# EasyEDA Pro project main_board.eprj

# Schematic Schematic1
Board Name: Board1; Create Date: 2025-07-29; Page Name: P1; Project Name: main_board; Schematic Name: Schematic1; Update Date: 2025-08-04; Company: EasyEDA.com; Page Size: A4; Version: V1.0
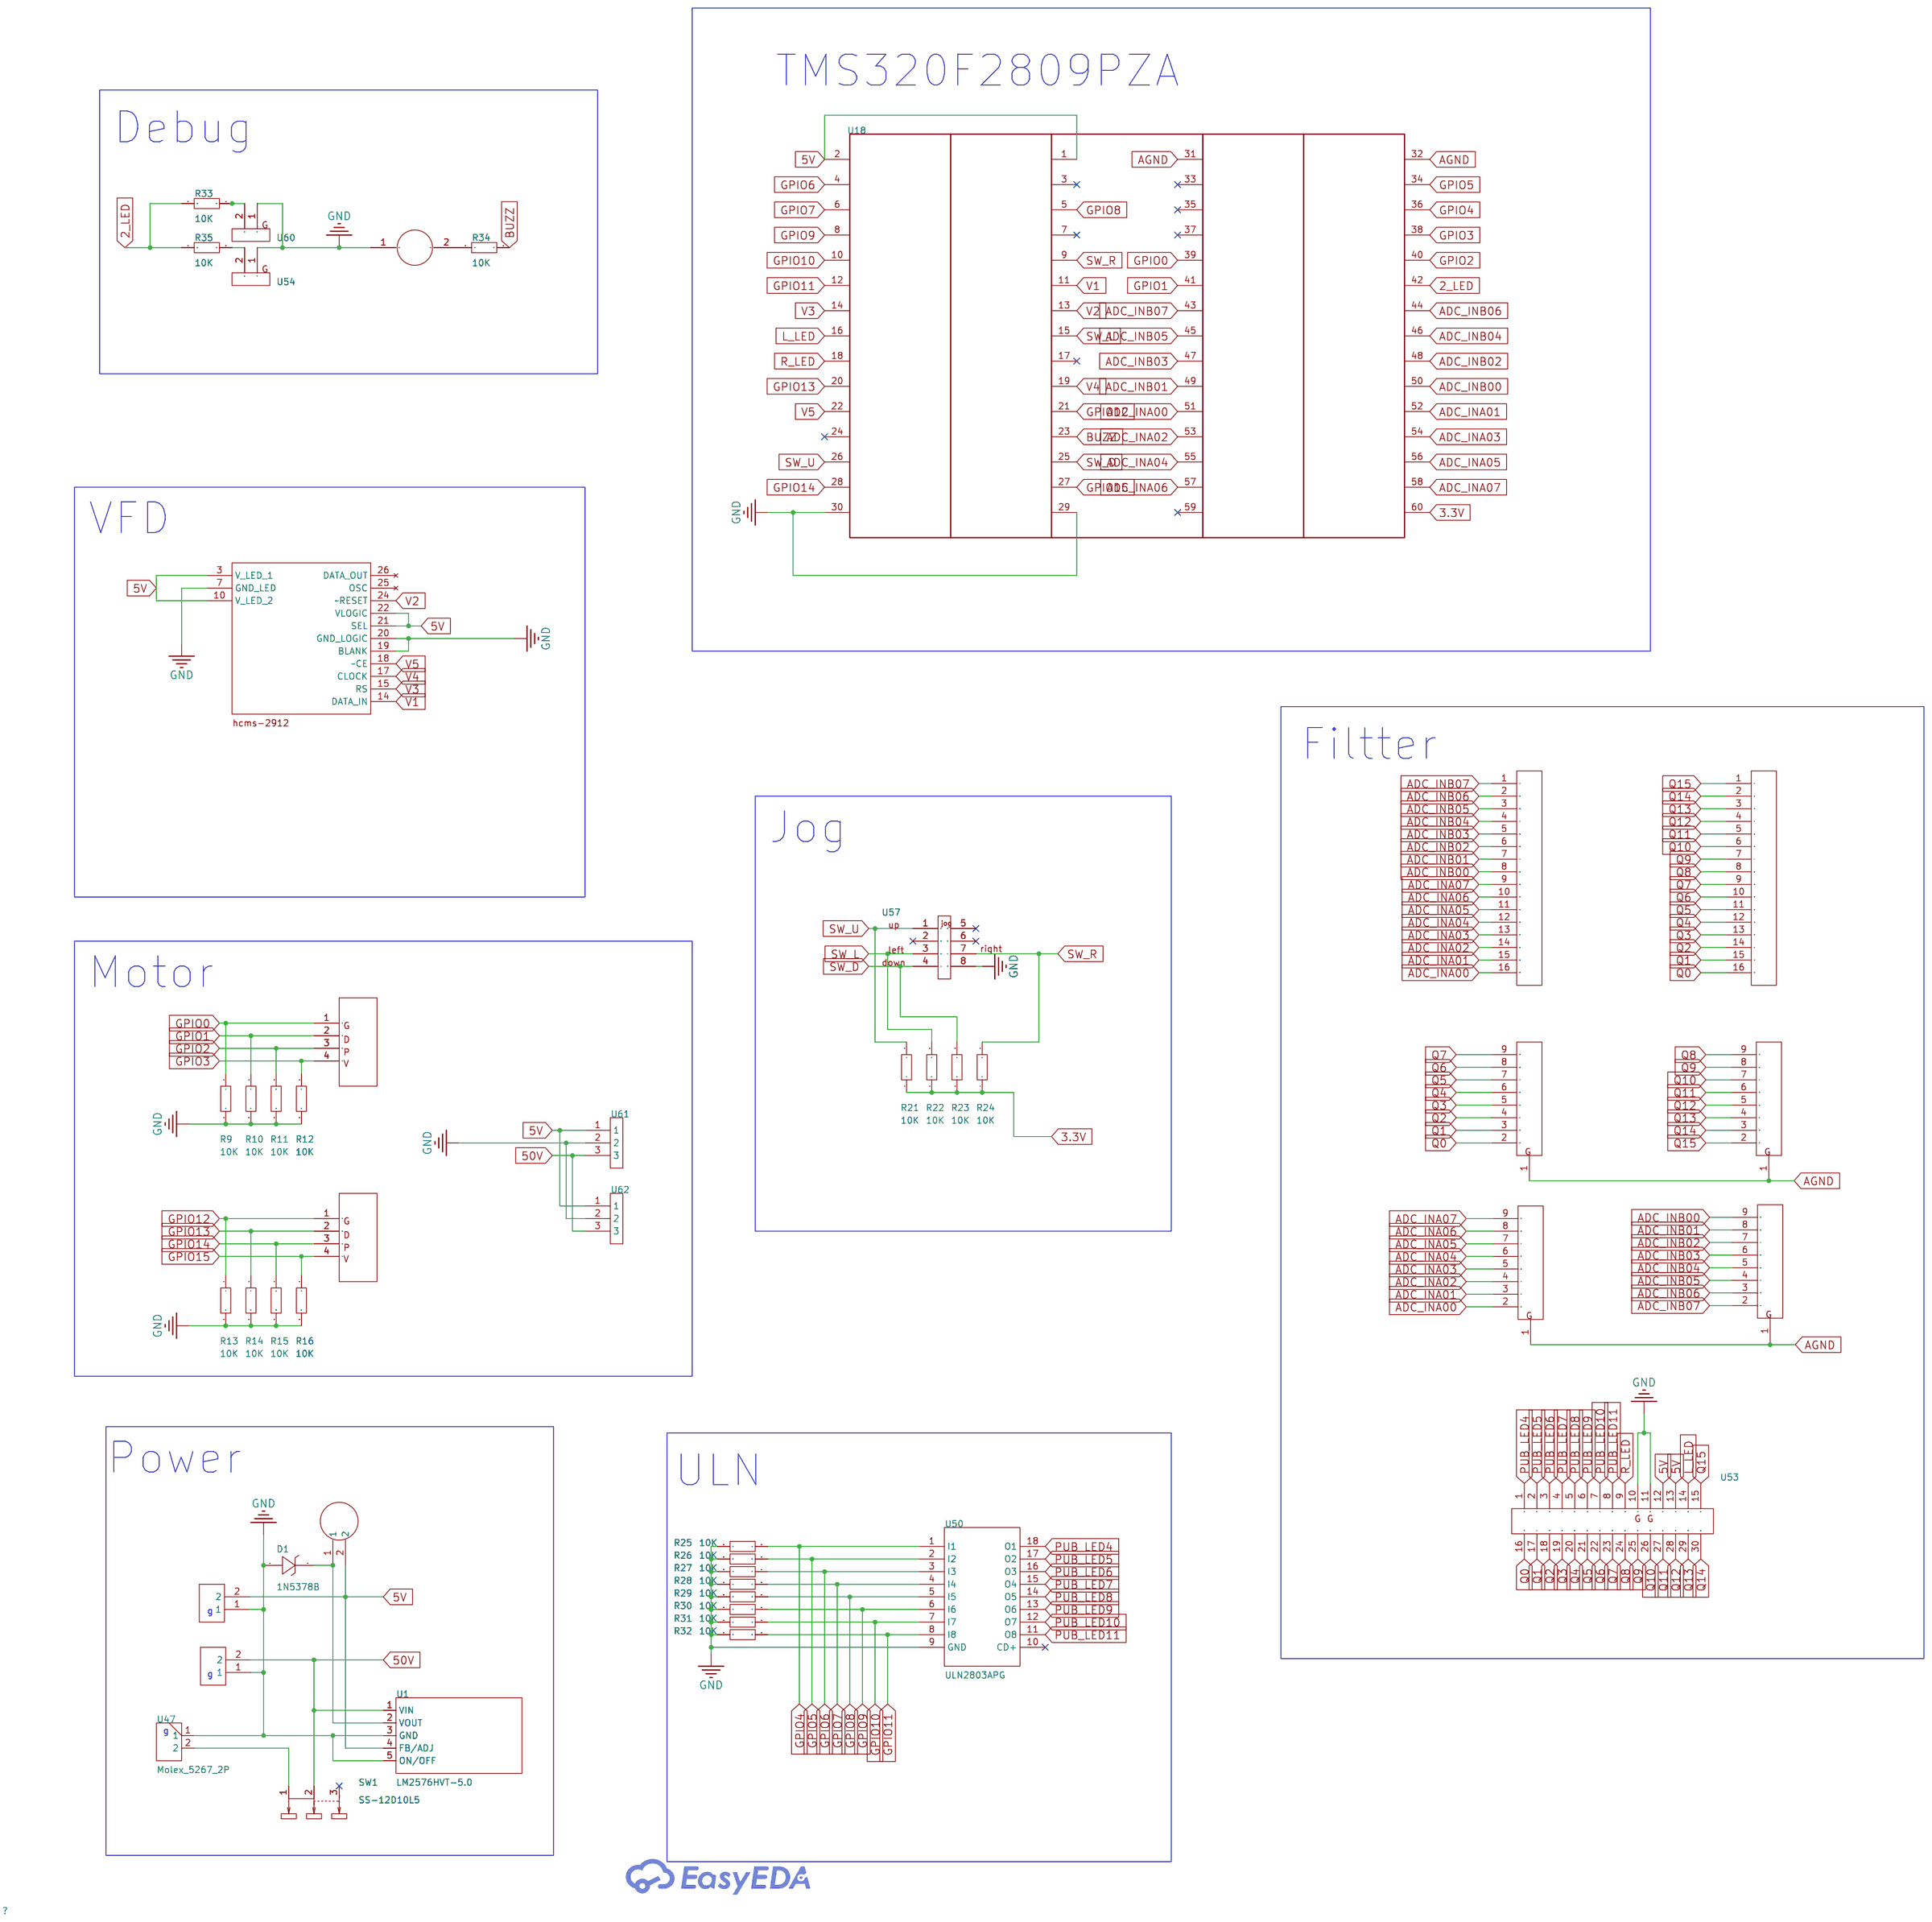
[diagram p0: schematic sheet]

## Parts
C1  -  [100uF Capacitor]
C2  -  [1000uF Capacitor]
D1  1N5378B  [DO-15_BD3.1-L6.7-P10.70-D0.9-FD]
L1  -  [Indoctor]
R9  10K  [R0603]
R10  10K  [R0603]
R11  10K  [R0603]
R12  10K  [R0603]
R13  10K  [R0603]
R14  10K  [R0603]
R15  10K  [R0603]
R16  10K  [R0603]
R21  10K  [R0603]
R22  10K  [R0603]
R23  10K  [R0603]
R24  10K  [R0603]
R25  10K  [R0603]
R26  10K  [R0603]
R27  10K  [R0603]
R28  10K  [R0603]
R29  10K  [R0603]
R30  10K  [R0603]
R31  10K  [R0603]
R32  10K  [R0603]
R33  10K  [R0603]
R34  10K  [R0603]
R35  10K  [R0603]
SW1  SS-12D10L5  [SW-TH_SS-12D10L5]
U1  LM2576HVT-5.0  [TO-220-5L_L10.2-W4.5-P1.71-L]
U4  Driver_R  [DC_Main_to_Motordriver_Connector_L]
U6  -  [BUZZER]
U10  -  [HCMS-2912]
U11  -  [Array]
U12  -  [Array]
U15  -  [C_Array]
U16  -  [C_Array]
U18  -  [2809PCB]
U47  Molex_5267_2P  [5267_2P]
U48  Driver_L  [DC_Main_to_Motordriver_Connector_L]
U50  ULN2803APG  [DIP-18_L23.0-W6.5-P2.54-LS7.6-BL]
U51  -  [Array]
U52  -  [Array]
U53  -  [pin2*15]
U54  -  [pub_pin]
U57  -  [jog]
U60  -  [pub_pin]
U61  -  [pin]
U62  -  [pin]

## Library data of the parts
C1 = 100uF Capacitor
C2 = 1000uF Capacitor
D1 = 1N5378B: Zener Voltage(Nom):100V Reverse Leakage Current (Ir):500nA@76V Pd - Power Dissipation:5W Impedance(Zzt):90Ω; Supplier Part: C2988330; Manufacturer: EIC; Supplier Footprint: DO-15; JLCPCB Part Class: Extended Part; Datasheet: https://atta.szlcsc.com/upload/public/pdf/source/20220402/75CFD8A39FA764DF5610AA6DE4D072CD.pdf; Supplier: LCSC; Zener Voltage(Nom): 100V; Reverse Leakage Current (Ir): 500nA@76V; Pd - Power Dissipation: 5W; Impedance(Zzt): 90Ω
L1 = Indoctor
R9-R16 R21-R35 = Res_0603: Supplier Footprint: 0603
SW1 = SS-12D10L5: LCSC Part Name: 柄长5mm 直插双档 滑动开关; Supplier Part: C319012; Manufacturer: XKB Connectivity(中国星坤); Supplier Footprint: 插件; JLCPCB Part Class: Extended Part; Datasheet: https://atta.szlcsc.com/upload/public/pdf/source/20211009/D6412F37AABE6F9459A6EE7FA4DAEADB.pdf; Supplier: LCSC; Circuit: SPDT; Actuator Style: Rectangular columnar; Pin Style: PCPin; Switch Length: 13mm; Switch Width: 6.8mm; Switch Height: 6.4mm; Mounting Style: Straight; Actuator Color: Black; Current Rating (DC): 3A; Voltage Rating (DC): 125V; Current Rating (AC): 3A; Voltage Rating (AC): 125V; Mechanical Life: 1万次; Operating Temperature: -40℃~+85℃
U1 = LM2576HVT-5.0_C262789: Function:Step-down type Output Type:- Voltage - Supply:- Voltage - Supply:- Output Voltage:- Output Voltage:- Output Current:3A Frequency - Switching:52kHz Frequency - Switching:52kHz Operating Temperature:-40℃~+125℃ Operating Temperature:-40℃~+125℃ Synch; Supplier Part: C262789; Manufacturer: HTC; Supplier Footprint: TO-220-5; JLCPCB Part Class: Extended Part; Datasheet: https://atta.szlcsc.com/upload/public/pdf/source/20191203/C126037_E42ABC3D16C6AA3446C45CA7229A4210.pdf; Supplier: LCSC; Function: Step-down type; Output Current: 3A; Frequency - Switching: 52kHz; Operating Temperature: -40℃~+125℃; Number of Outputs: 1; Topology: Step-down; Switch tube (built-in/external): Built-in
U4 U48 = DC_Main_to_Motordriver_Connector
U6 = BUZZER
U10 = HCMS-2912
U11 U12 U51 U52 = Array
U15 U16 = C_Array
U18 = TMS320F2809PZA_DIP
U47 = Molex_5267_2P
U50 = ULN2803APG: LCSC Part Name: 停产 ULN2803APG; Supplier Part: C5252; Manufacturer: TOSHIBA(东芝); Supplier Footprint: DIP-18; JLCPCB Part Class: Extended Part; Datasheet: https://atta.szlcsc.com/upload/public/pdf/source/20120920/1457706536068.pdf; Supplier: LCSC; number of channels: Eight channels
U53 = pin2*15
U54 U60 = pub_pin
U57 = jog
U61 U62 = 3pin

## Nets
3.3V: R21.1 R22.1 R23.1 R24.1 U18.60
5V: C2.2 L1.2 U1.4(FB/ADJ) U10.3(V_LED_1) U10.10(V_LED_2) U10.21(SEL) U10.22(VLOGIC) U18.1 U18.2 U53.12 U53.13 U61.1 U62.1
50V: C1.2 SW1.2 U1.1(VIN) U61.3 U62.3
AGND: U11.1 U12.1 U18.31 U18.32 U51.1 U52.1
GND: C1.1 C2.1 D1.1(+) R9.2 R10.2 R11.2 R12.2 R13.2 R14.2 R15.2 R16.2 R25.2 R26.2 R27.2 R28.2 R29.2 R30.2 R31.2 R32.2 U1.3(GND) U1.5(ON/OFF) U6.1 U10.7(GND_LED) U10.19(BLANK) U10.20(GND_LOGIC) U18.29 U18.30 U47.1 U50.9(GND) U53.10 U53.11 U54.1 U57.8 U60.1 U61.2 U62.2
V1: U10.14(DATA_IN) U18.11
V2: U10.24(~RESET) U18.13
V3: U10.15(RS) U18.14
V4: U10.17(CLOCK) U18.19
V5: U10.18(~CE) U18.22
2_LED: R33.1 R35.1 U18.42
ADC_INA00: U15.16 U18.51 U51.2
ADC_INA01: U15.15 U18.52 U51.3
ADC_INA02: U15.14 U18.53 U51.4
ADC_INA03: U15.13 U18.54 U51.5
ADC_INA04: U15.12 U18.55 U51.6
ADC_INA05: U15.11 U18.56 U51.7
ADC_INA06: U15.10 U18.57 U51.8
ADC_INA07: U15.9 U18.58 U51.9
ADC_INB00: U15.8 U18.50 U52.9
ADC_INB01: U15.7 U18.49 U52.8
ADC_INB02: U15.6 U18.48 U52.7
ADC_INB03: U15.5 U18.47 U52.6
ADC_INB04: U15.4 U18.46 U52.5
ADC_INB05: U15.3 U18.45 U52.4
ADC_INB06: U15.2 U18.44 U52.3
ADC_INB07: U15.1 U18.43 U52.2
BUZZ: R34.2 U18.23
GPIO0: R9.1 U4.1 U18.39
GPIO1: R10.1 U4.2 U18.41
GPIO2: R11.1 U4.3 U18.40
GPIO3: R12.1 U4.4 U18.38
GPIO4: R25.1 U18.36 U50.1(I1)
GPIO5: R26.1 U18.34 U50.2(I2)
GPIO6: R27.1 U18.4 U50.3(I3)
GPIO7: R28.1 U18.6 U50.4(I4)
GPIO8: R29.1 U18.5 U50.5(I5)
GPIO9: R30.1 U18.8 U50.6(I6)
GPIO10: R31.1 U18.10 U50.7(I7)
GPIO11: R32.1 U18.12 U50.8(I8)
GPIO12: R13.1 U18.21 U48.1
GPIO13: R14.1 U18.20 U48.2
GPIO14: R15.1 U18.28 U48.3
GPIO15: R16.1 U18.27 U48.4
L_LED: U18.16 U53.14
PUB_LED4: U50.18(O1) U53.1
PUB_LED5: U50.17(O2) U53.2
PUB_LED6: U50.16(O3) U53.3
PUB_LED7: U50.15(O4) U53.4
PUB_LED8: U50.14(O5) U53.5
PUB_LED9: U50.13(O6) U53.6
PUB_LED10: U50.12(O7) U53.7
PUB_LED11: U50.11(O8) U53.8
Q0: U11.2 U16.16 U53.16
Q1: U11.3 U16.15 U53.17
Q2: U11.4 U16.14 U53.18
Q3: U11.5 U16.13 U53.19
Q4: U11.6 U16.12 U53.20
Q5: U11.7 U16.11 U53.21
Q6: U11.8 U16.10 U53.22
Q7: U11.9 U16.9 U53.23
Q8: U12.9 U16.8 U53.24
Q9: U12.8 U16.7 U53.25
Q10: U12.7 U16.6 U53.26
Q11: U12.6 U16.5 U53.27
Q12: U12.5 U16.4 U53.28
Q13: U12.4 U16.3 U53.29
Q14: U12.3 U16.2 U53.30
Q15: U12.2 U16.1 U53.15
R_LED: U18.18 U53.9
SW_D: R23.2 U18.25 U57.4
SW_L: R22.2 U18.15 U57.3
SW_R: R24.2 U18.9 U57.7
SW_U: R21.2 U18.26 U57.1
$1N2932: SW1.1 U47.2
$1N3052: D1.2(-) L1.1 U1.2(VOUT)
$1N13779: R34.1 U6.2
$1N16910: R33.2 U60.2
$1N16913: R35.2 U54.2

Not connected (* = marked no-connect by the designer): SW1 3*; U10 25(OSC) 26(DATA_OUT); U18 3* 7* 17* 24* 33* 35* 37* 59*; U50 10(CD+)*; U57 2* 5* 6*

## Notes on the sheet
- TMS320F2809PZA
- Debug
- VFD
- Filtter
- Jog
- Motor
- Power
- ULN
- g
- g
- g

# Board PCB1
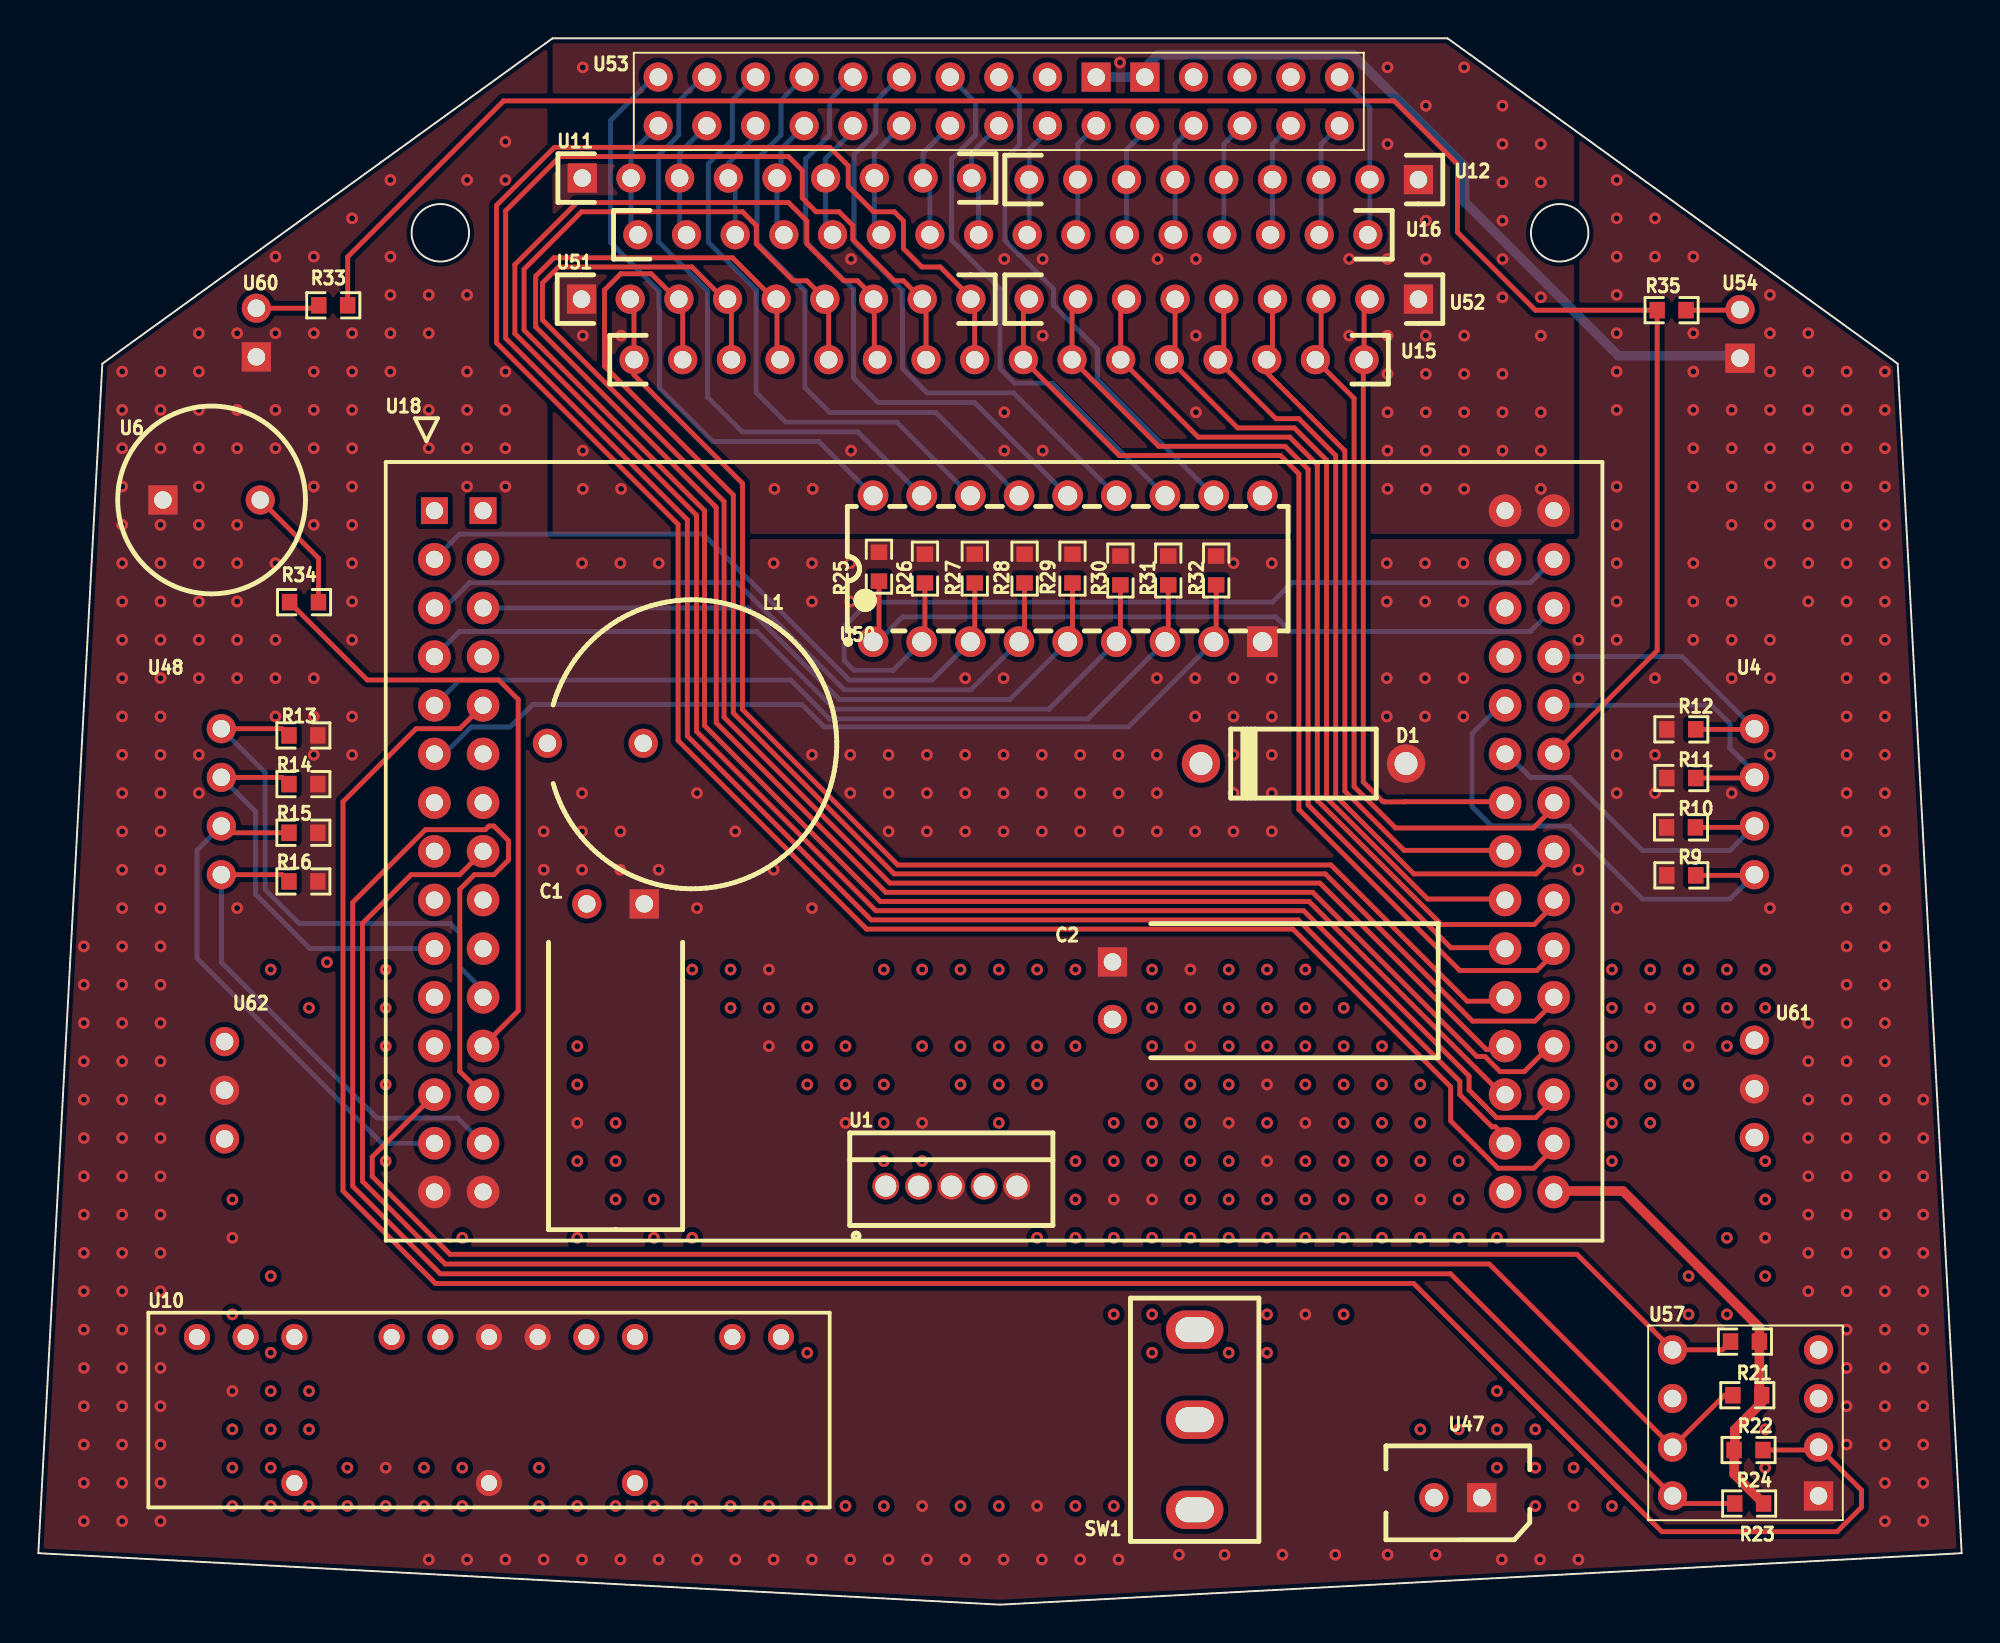
[diagram p1: board, top side]
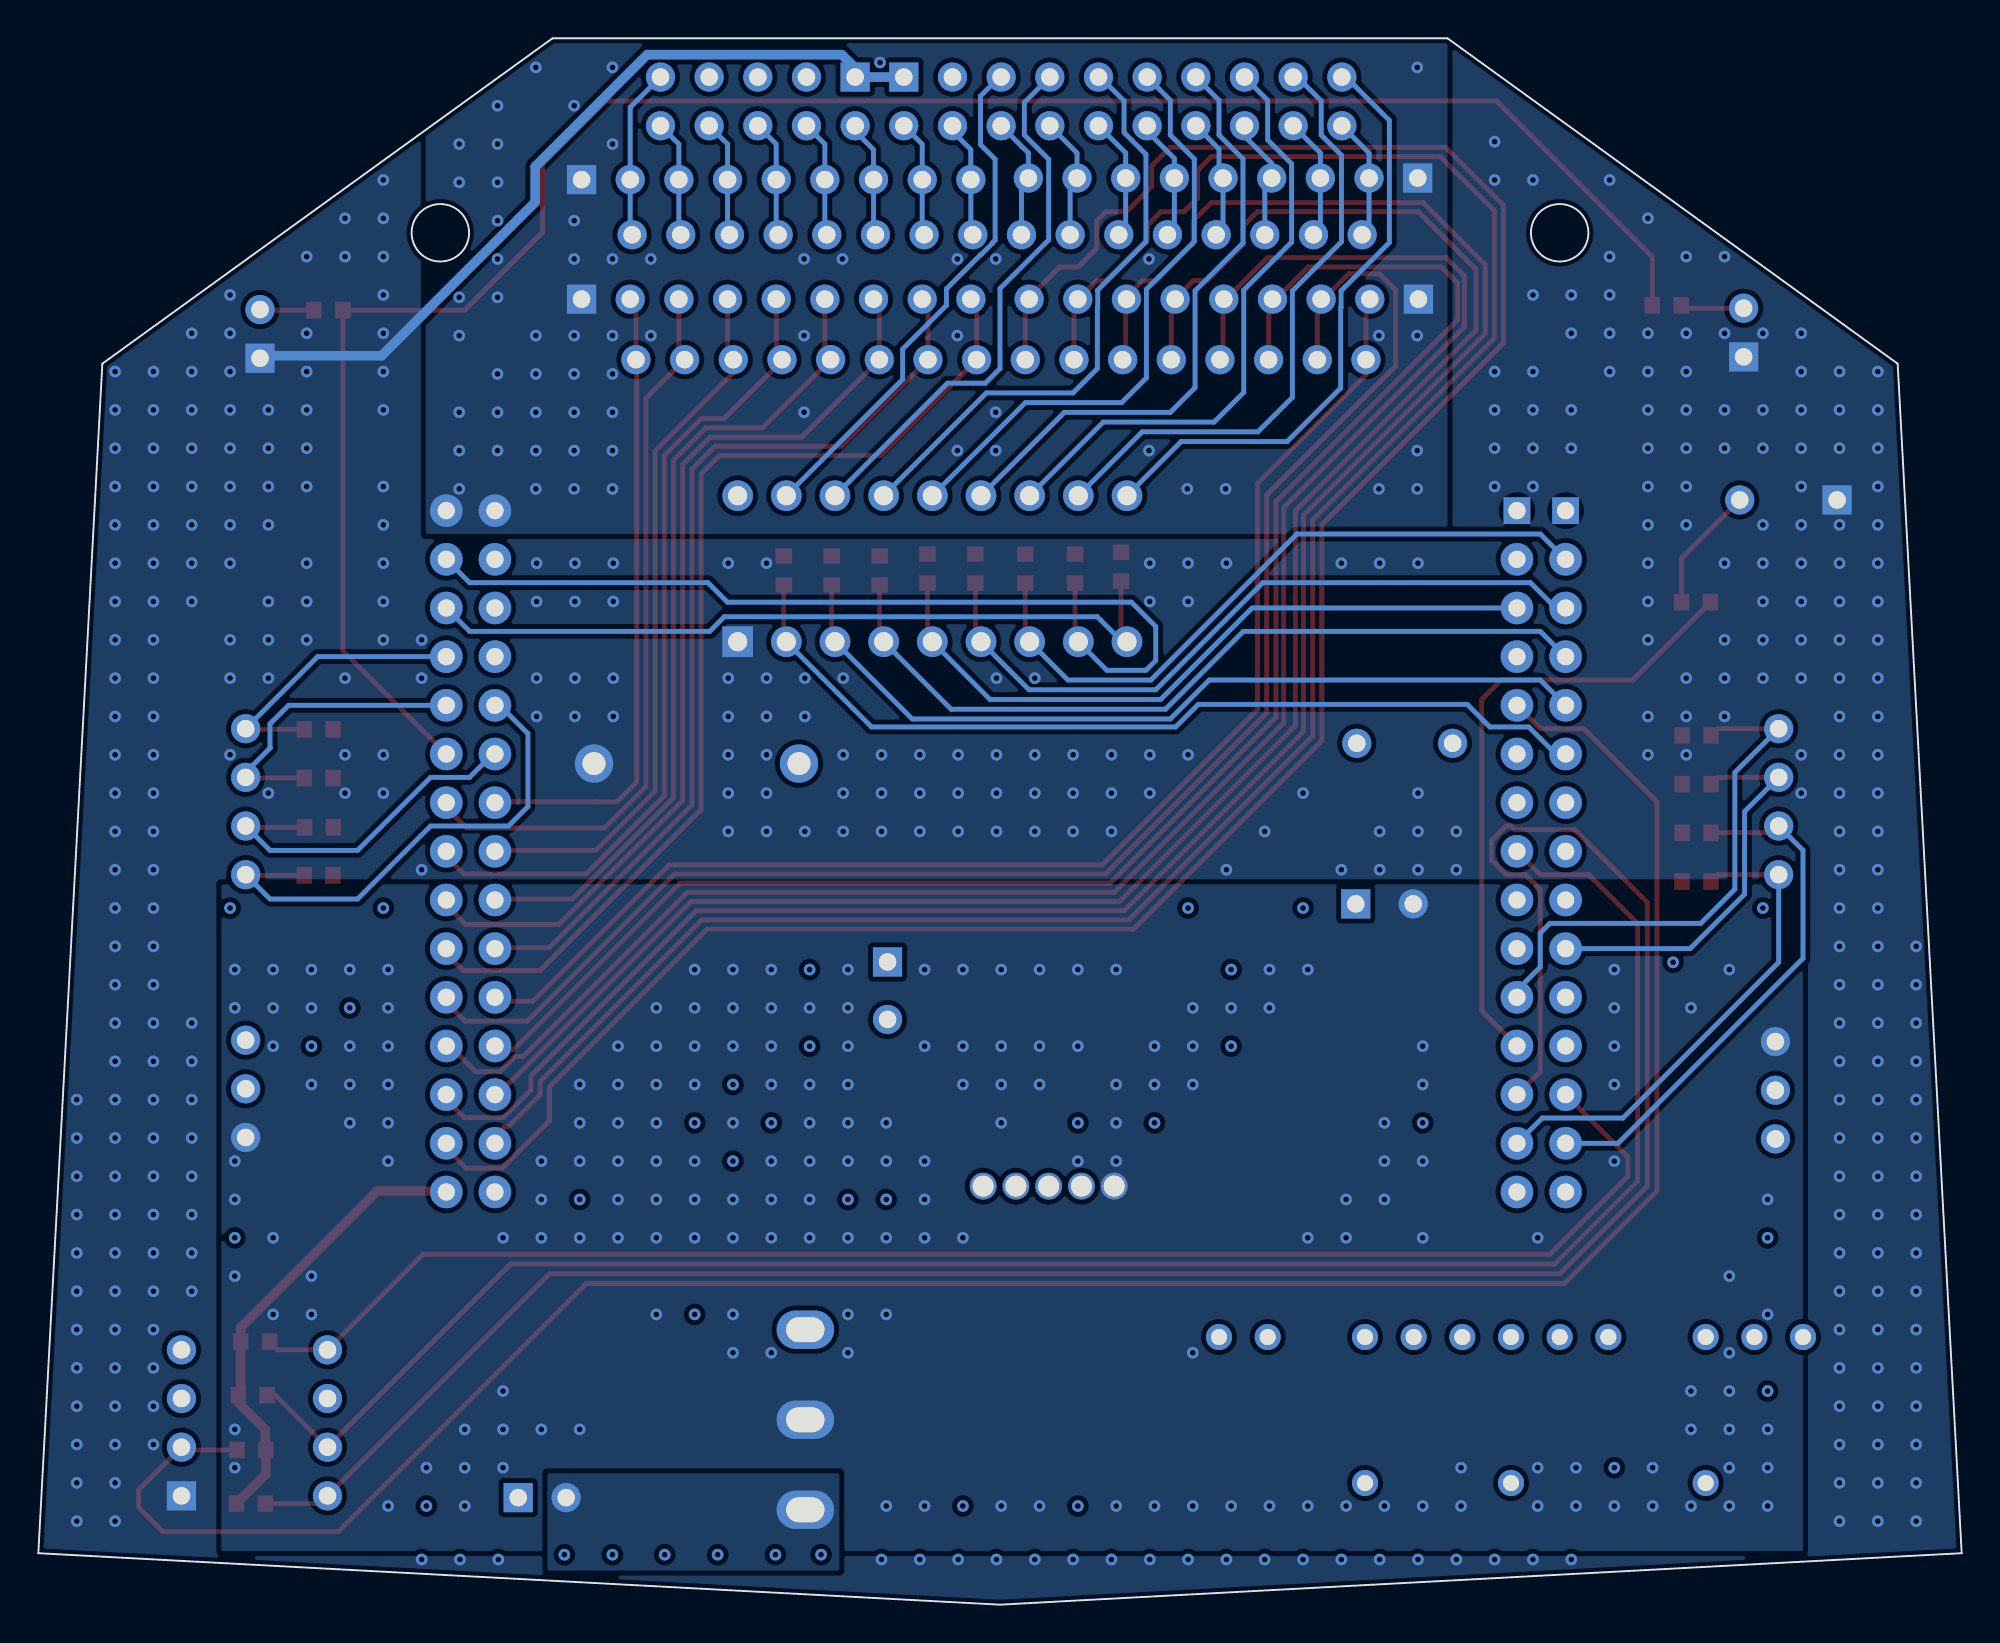
[diagram p2: board, bottom side, seen from below]

Outline 100.38 x 81.75 mm; copper layers: Top Layer, Inner1, Inner2, Bottom Layer. Coordinates in mm from the lower left corner of the outline.
Outline path: circle c20.98,71.6 r1.5 ; circle c79.4,71.6 r1.5 ; 0,2.69 3.34,64.77 26.83,81.75 73.55,81.75 97.04,64.77 100.38,2.69 50.19,0 0,2.69
Stack: Top Layer 0.035mm Outer layer thickness 1oz / Dielectric1 0.2104mm 7628 RC49% 8.6mil / Inner1 0.0152mm Inner layer thickness / Dielectric2 1.065mm 1.1mm H/HOZ Copper / Inner2 0.0152mm Inner layer thickness / Dielectric3 0.2104mm 7628 RC49% 8.6mil / Bottom Layer 0.035mm Outer layer thickness 1oz

## Design rules (mm)
template: Custom Config
spacing copperThickness1oz (default): track to track 0.102, other pairs 0.152 to 0.3
spacing copperThickness2oz: track to track 0.203, other pairs 0.152 to 0.3
track width copperThickness1oz (default): min 0.127, default 0.254, max 2.54
track width copperThickness2oz: min 0.203, default 0.254, max 2.54
differential pair differentialPair (default): width min 0.127, default 0.254, max 2.54; gap min 0.152, default 0.152
via viaSize (default): diameter min 0.5, default 0.61, max 10; hole min 0.3, default 0.305, max 6.3

## Placement (name value [footprint] x y rotation side)
C1  -  [100uF Capacitor]  30.13 36.58 180 top
C2  -  [1000uF Capacitor]  56.06 32.05 270 top
D1  1N5378B  [DO-15_BD3.1-L6.7-P10.70-D0.9-FD]  66.03 43.9 180 top
L1  -  [Indoctor]  26.57 44.96 270 top
R9  10K  [R0603]  85.75 38.07 180 top
R10  10K  [R0603]  85.73 40.57 180 top
R11  10K  [R0603]  85.75 43.15 180 top
R12  10K  [R0603]  85.75 45.69 180 top
R13  10K  [R0603]  13.84 45.37 0 top
R14  10K  [R0603]  13.84 42.83 0 top
R15  10K  [R0603]  13.84 40.29 0 top
R16  10K  [R0603]  13.84 37.75 0 top
R21  10K  [R0603]  89.07 13.73 180 top
R22  10K  [R0603]  89.19 10.93 180 top
R23  10K  [R0603]  89.29 5.28 180 top
R24  10K  [R0603]  89.26 8.07 0 top
R25  10K  [R0603]  43.87 54.18 90 top
R26  10K  [R0603]  46.27 54.08 90 top
R27  10K  [R0603]  48.87 54.08 90 top
R28  10K  [R0603]  51.47 54.08 90 top
R29  10K  [R0603]  53.97 54.08 90 top
R30  10K  [R0603]  56.47 53.98 90 top
R31  10K  [R0603]  58.97 53.98 90 top
R32  10K  [R0603]  61.47 53.98 90 top
R33  10K  [R0603]  15.39 67.82 180 top
R34  10K  [R0603]  13.87 52.32 180 top
R35  10K  [R0603]  85.24 67.56 0 top
SW1  SS-12D10L5  [SW-TH_SS-12D10L5]  60.35 9.65 90 top
U1  LM2576HVT-5.0  [TO-220-5L_L10.2-W4.5-P1.71-L]  47.65 21.84 0 top
U4  Driver_R  [DC_Main_to_Motordriver_Connector_L]  89.56 41.91 180 top
U6  -  [BUZZER]  9.04 57.66 0 top
U10  -  [HCMS-2912]  13.36 6.35 0 top
U11  -  [Array]  28.39 74.46 0 top
U12  -  [Array]  72.03 74.38 180 top
U15  -  [C_Array]  69.19 64.98 180 top
U16  -  [C_Array]  69.39 71.5 180 top
U18  TMS320F2809PZA_DIP  [2809PCB]  20.67 57.1 0 top
U47  Molex_5267_2P  [5267_2P]  75.34 5.59 180 top
U48  Driver_L  [DC_Main_to_Motordriver_Connector_L]  9.55 41.91 0 top
U50  ULN2803APG  [DIP-18_L23.0-W6.5-P2.54-LS7.6-BL]  53.72 54.07 0 top
U51  -  [Array]  28.35 68.14 0 top
U52  -  [Array]  72.03 68.14 180 top
U53  -  [pin2*15]  42.51 78.46 0 top
U54  -  [pub_pin]  88.81 66.71 180 top
U57  -  [jog]  89.1 9.49 0 top
U60  -  [pub_pin]  11.38 66.78 180 top
U61  -  [pin]  89.56 26.92 270 top
U62  -  [pin]  9.72 26.85 90 top

## Footprints (pads in the part's own frame, mm; a bottom-side part is the same pattern mirrored in y, then rotated)
100uF Capacitor
  rect 1.524x1.524 hole 0.914: 1(-1.5,0)
  round 1.524 hole 0.914: 2(1.5,0)
1000uF Capacitor
  rect 1.524x1.524 hole 0.914: 1(-1.5,0)
  round 1.524 hole 0.914: 2(1.5,0)
2809PCB
  rect 1.4x1.4 hole 0.9: 1(2.54,0) 2(0,0)
  round 1.7 hole 0.9: 3(2.54,-2.54) 4(0,-2.54) 5(2.54,-5.08) 6(0,-5.08) 7(2.54,-7.62) 8(0,-7.62) 9(2.54,-10.16) 10(0,-10.16) 11(2.54,-12.7) 12(0,-12.7) 13(2.54,-15.24) 14(0,-15.24) 15(2.54,-17.78) 16(0,-17.78) 17(2.54,-20.32) 18(0,-20.32) 19(2.54,-22.86) 20(0,-22.86) 21(2.54,-25.4) 22(0,-25.4) 23(2.54,-27.94) 24(0,-27.94) 25(2.54,-30.48) 26(0,-30.48) 27(2.54,-33.02) 28(0,-33.02) 29(2.54,-35.56) 30(0,-35.56) 31(55.88,0) 32(58.42,0) 33(55.88,-2.54) 34(58.42,-2.54) 35(55.88,-5.08) 36(58.42,-5.08) 37(55.88,-7.62) 38(58.42,-7.62) 39(55.88,-10.16) 40(58.42,-10.16) 41(55.88,-12.7) 42(58.42,-12.7) 43(55.88,-15.24) 44(58.42,-15.24) 45(55.88,-17.78) 46(58.42,-17.78) 47(55.88,-20.32) 48(58.42,-20.32) 49(55.88,-22.86) 50(58.42,-22.86) 51(55.88,-25.4) 52(58.42,-25.4) 53(55.88,-27.94) 54(58.42,-27.94) 55(55.88,-30.48) 56(58.42,-30.48) 57(55.88,-33.02) 58(58.42,-33.02) 59(55.88,-35.56) 60(58.42,-35.56)
5267_2P
  rect 1.524x1.524 hole 0.914: 1(0,0)
  round 1.524 hole 0.914: 2(2.5,0)
Array
  rect 1.524x1.524 hole 0.914: 1(0,0)
  round 1.524 hole 0.914: 2(2.54,0) 3(5.08,0) 4(7.62,0) 5(10.16,0) 6(12.7,0) 7(15.24,0) 8(17.78,0) 9(20.32,0)
BUZZER
  rect 1.524x1.524 hole 0.914: 1(-2.54,0)
  round 1.524 hole 0.914: 2(2.54,0)
C_Array
  round 1.524 hole 0.914: 1(0,0) 2(2.54,0) 3(5.08,0) 4(7.62,0) 5(10.16,0) 6(12.7,0) 7(15.24,0) 8(17.78,0) 9(20.32,0) 10(22.86,0) 11(25.4,0) 12(27.94,0) 13(30.48,0) 14(33.02,0) 15(35.56,0) 16(38.1,0)
DC_Main_to_Motordriver_Connector_L
  round 1.524 hole 0.914: 0(0,3.81) 1(0,1.27) 2(0,-1.27) 3(0,-3.81)
DIP-18_L23.0-W6.5-P2.54-LS7.6-BL
  round 1.6 hole 1: 1(-10.16,-3.81) 2(-7.62,-3.81) 3(-5.08,-3.81) 4(-2.54,-3.81) 5(0,-3.81) 6(2.54,-3.81) 7(5.08,-3.81) 8(7.62,-3.81) 10(10.16,3.81) 11(7.62,3.81) 12(5.08,3.81) 13(2.54,3.81) 14(0,3.81) 15(-2.54,3.81) 16(-5.08,3.81) 17(-7.62,3.81) 18(-10.16,3.81)
  rect 1.6x1.6 hole 1: 9(10.16,-3.81)
DO-15_BD3.1-L6.7-P10.70-D0.9-FD
  round 2 hole 1.2: 1(-5.35,0) 2(5.35,0)
HCMS-2912
  round 1.365 hole 0.84: 3(0,0) 7(10.16,0) 10(17.78,0) 14(25.4,7.62) 15(22.86,7.62) 17(17.78,7.62) 18(15.24,7.62) 19(12.7,7.62) 20(10.16,7.62) 21(7.62,7.62) 22(5.08,7.62) 24(0,7.62) 25(-2.54,7.62) 26(-5.08,7.62)
Indoctor
  round 1.524 hole 0.914: 1(0,0) 2(0,5)
jog
  round 1.524 hole 0.914: 2(-3.81,1.27) 5(3.81,3.81) 6(3.81,1.27) D(-3.81,-3.81) L(-3.81,-1.27) R(3.81,-1.27) U(-3.81,3.81)
  rect 1.524x1.524 hole 0.914: 8(3.81,-3.81)
pin
  round 1.524 hole 0.914: 1(-2.54,0) 2(0,0) 3(2.54,0)
pin2*15
  round 1.524 hole 0.914: 1(-10.16,1.27) 2(-7.62,1.27) 3(-5.08,1.27) 4(-2.54,1.27) 5(0,1.27) 6(2.54,1.27) 7(5.08,1.27) 8(7.62,1.27) 9(10.16,1.27) 12(17.78,1.27) 13(20.32,1.27) 14(22.86,1.27) 15(25.4,1.27) 16(-10.16,-1.27) 17(-7.62,-1.27) 18(-5.08,-1.27) 19(-2.54,-1.27) 20(0,-1.27) 21(2.54,-1.27) 22(5.08,-1.27) 23(7.62,-1.27) 24(10.16,-1.27) 25(12.7,-1.27) 26(15.24,-1.27) 27(17.78,-1.27) 28(20.32,-1.27) 29(22.86,-1.27) 30(25.4,-1.27)
  rect 1.524x1.524 hole 0.914: 10(12.7,1.27) 11(15.24,1.27)
pub_pin
  rect 1.524x1.524 hole 0.914: 1(0,1.651)
  round 1.524 hole 0.914: 2(0,-0.889)
R0603
  rect 0.806x0.864 smd: 1(-0.753,0) 2(0.753,0)
SW-TH_SS-12D10L5
  oval 2x3 hole 1.3x2: 1(-4.7,0) 2(0,0) 3(4.7,0)
TO-220-5L_L10.2-W4.5-P1.71-L
  round 1.4 hole 1.1: 1(-3.42,0) 2(-1.71,0) 3(0,0) 4(1.71,0) 5(3.42,0)

## Nets
As in the schematic, except:
GPIO0: R9.1 U4.0 U18.39
GPIO1: R10.1 U4.1 U18.41
GPIO2: R11.1 U4.2 U18.40
GPIO3: R12.1 U4.3 U18.38
GPIO12: R13.1 U18.21 U48.0
GPIO13: R14.1 U18.20 U48.1
GPIO14: R15.1 U18.28 U48.2
GPIO15: R16.1 U18.27 U48.3
SW_D: R23.2 U18.25 U57.D
SW_L: R22.2 U18.15 U57.L
SW_R: R24.2 U18.9 U57.R
SW_U: R21.2 U18.26 U57.U

Pads without a net: SW1 3; U10 25 26; U18 3 7 17 24 33 35 37 59; U50 10; U57 2 5 6

## Via types
v1: diameter 0.61, hole 0.305, Top Layer to Bottom Layer, 669 vias

## Routing (per net, layer and track width the routed paths; a pad name or vN(x,y) marks a point on that pad's centre or on a via; arc(x,y) is an arc through that point)
3.3V: length 23.8
  Top Layer w0.5: 79.4,21.59 82.7,21.59 89.83,14.47 R21.1 89.83,11.05 R22.1 89.95,10.55 88.55,9.14 88.55,8.11 R24.1 88.51,6.82 R23.1
5V: length 248.8
  Inner1 w0.5: 49.36,20.32 U1.4 49.42,21.84 56.06,28.48 C2.2 44.46,30.55 31.57,43.43 L1.2 31.57,48.74 U18.1 U18.2 ; 49.36,20.32 35.39,6.35 U10.10 28.6,6.35 U10.21 U10.22 ; 49.36,20.32 52.66,17.02 77.12,17.02 U61.1 92.36,32.26 92.36,50.55 74.07,68.83 74.07,78.49 71.53,81.03 61.37,81.03 60.29,79.95 U53.12 U53.13 ; U10.22 18.44,11.43 U10.3 ; U10.22 9.72,22.69 U62.1
  Bottom Layer w0.254: C2.2 56.06,30.8
50V:
  vias: v1(10.13,21.15) v1(10.13,15.15) v1(10.13,9.15) v1(10.13,7.15) v1(10.13,5.15) v1(12.13,33.15) v1(12.13,17.15) v1(12.13,13.15) v1(12.13,11.15) v1(12.13,9.15) v1(12.13,7.15) v1(12.13,5.15) v1(14.13,31.15) v1(14.13,11.15) v1(14.13,9.15) v1(14.13,5.15) v1(16.13,7.15) v1(16.13,5.15) v1(18.13,33.15) v1(18.13,31.15) v1(18.13,29.15) v1(18.13,27.15) v1(18.13,23.15) v1(18.13,5.15) v1(20.13,7.15) v1(20.13,5.15) v1(22.13,19.15) v1(22.13,7.15) v1(22.13,5.15) v1(26.13,7.15) v1(26.13,5.15) v1(28.13,29.15) v1(28.13,27.15) v1(28.13,23.15) v1(28.13,19.15) v1(28.13,5.15) v1(30.13,25.15) v1(30.13,23.15) v1(30.13,21.15) v1(30.13,5.15) v1(32.13,21.15) v1(32.13,19.15) v1(32.13,5.15) v1(34.13,33.15) v1(34.13,19.15) v1(34.13,5.15) v1(36.13,33.15) v1(36.13,31.15) v1(36.13,5.15) v1(38.13,31.15) v1(38.13,5.15) v1(40.13,31.15) v1(40.13,29.15) v1(40.13,27.15) v1(40.13,13.15) v1(40.13,5.15) v1(42.13,29.15) v1(42.13,27.15) v1(42.13,5.15) v1(44.13,33.15) v1(44.13,27.15) v1(44.13,25.15) v1(44.13,23.15) v1(44.13,5.15) v1(46.13,33.15) v1(46.13,29.15) v1(46.13,23.15) v1(48.13,33.15) v1(48.13,29.15) v1(48.13,27.15) v1(48.13,5.15) v1(50.13,33.15) v1(50.13,29.15) v1(50.13,27.15) v1(50.13,25.15) v1(50.13,5.15) v1(52.13,33.15) v1(52.13,29.15) v1(52.13,27.15) v1(52.13,19.15) v1(54.13,33.15) v1(54.13,29.15) v1(54.13,23.15) v1(54.13,21.15) v1(54.13,19.15) v1(54.13,5.15) v1(56.13,25.15) v1(56.13,23.15) v1(56.13,19.15) v1(56.13,15.15) v1(56.13,5.15) v1(58.13,33.15) v1(58.13,31.15) v1(58.13,29.15) v1(58.13,27.15) v1(58.13,25.15) v1(58.13,23.15) v1(58.13,19.15) v1(58.13,15.15) v1(58.13,13.15) v1(60.13,31.15) v1(60.13,27.15) v1(60.13,25.15) v1(60.13,23.15) v1(60.13,21.15) v1(60.13,19.15) v1(62.13,33.15) v1(62.13,31.15) v1(62.13,29.15) v1(62.13,27.15) v1(62.13,23.15) v1(62.13,21.15) v1(62.13,19.15) v1(62.13,13.15) v1(64.13,33.15) v1(64.13,31.15) v1(64.13,29.15) v1(64.13,25.15) v1(64.13,21.15) v1(64.13,19.15) v1(64.13,15.15) v1(64.13,13.15) v1(66.13,33.15) v1(66.13,31.15) v1(66.13,29.15) v1(66.13,27.15) v1(66.13,23.15) v1(66.13,21.15) v1(66.13,19.15) v1(68.13,31.15) v1(68.13,29.15) v1(68.13,27.15) v1(68.13,25.15) v1(68.13,23.15) v1(68.13,21.15) v1(68.13,19.15) v1(68.13,15.15) v1(70.13,29.15) v1(70.13,27.15) v1(70.13,25.15) v1(70.13,23.15) v1(70.13,21.15) v1(70.13,19.15) v1(72.13,27.15) v1(72.13,25.15) v1(72.13,23.15) v1(72.13,19.15) v1(72.13,9.15) v1(74.13,23.15) v1(74.13,21.15) v1(74.13,19.15) v1(74.13,9.15) v1(76.13,19.15) v1(76.13,11.15) v1(76.13,9.15) v1(76.13,7.15) v1(78.13,9.15) v1(78.13,7.15) v1(78.13,5.15) v1(80.13,7.15) v1(82.13,33.15) v1(82.13,31.15) v1(82.13,29.15) v1(82.13,27.15) v1(82.13,25.15) v1(82.13,23.15) v1(82.13,5.15) v1(84.13,33.15) v1(84.13,29.15) v1(84.13,27.15) v1(84.13,25.15) v1(86.13,33.15) v1(86.13,31.15) v1(86.13,27.15) v1(86.13,17.15) v1(86.13,15.15) v1(88.13,33.15) v1(88.13,31.15) v1(88.13,29.15) v1(88.13,19.15) v1(88.13,15.15) v1(90.13,33.15) v1(90.13,31.15) v1(90.13,23.15) v1(90.13,21.15) v1(90.13,17.15) v1(90.13,9.15) v1(90.13,7.15)
AGND:
  vias: v1(28.42,80.24) v1(28.42,66.24) v1(28.42,60.24) v1(28.42,58.24) v1(30.42,66.24) v1(30.42,58.24) v1(38.42,58.24) v1(40.42,58.24) v1(42.42,70.24) v1(42.42,60.24) v1(50.42,70.24) v1(50.42,62.24) v1(50.42,60.24) v1(52.42,70.24) v1(52.42,66.24) v1(52.42,60.24) v1(56.45,80.49) v1(58.42,70.24) v1(60.42,70.24) v1(60.42,66.24) v1(60.42,62.24) v1(68.42,70.24) v1(68.42,66.24) v1(70.42,80.24) v1(70.42,76.24) v1(70.42,70.24) v1(70.42,66.24) v1(70.42,64.24) v1(70.42,62.24) v1(70.42,60.24) v1(70.42,58.24) v1(72.42,78.24) v1(72.42,72.24) v1(72.42,70.24) v1(72.42,66.24) v1(72.42,64.24) v1(72.42,62.24) v1(72.42,60.24) v1(72.42,58.24) v1(74.42,80.24) v1(74.42,66.24) v1(74.42,64.24) v1(74.42,62.24) v1(74.42,60.24) v1(74.42,58.24) v1(76.42,78.24) v1(76.42,76.24) v1(76.42,74.24) v1(76.42,72.24) v1(76.42,70.24) v1(76.42,68.24) v1(76.42,64.24) v1(76.42,62.24) v1(76.42,60.24) v1(78.42,76.24) v1(78.42,74.24) v1(78.42,68.24) v1(78.42,66.24) v1(78.42,62.24) v1(78.42,60.24) v1(78.42,58.24)
GND: length 42.1
  Bottom Layer w0.5: U54.1 88.69,65.18 82.47,65.18 74.45,73.2 74.45,75.06 68.61,80.9 58.45,80.9 57.62,80.08 57.62,79.86 U53.11 U53.10
  vias: v1(2.38,34.36) v1(2.38,32.36) v1(2.38,30.36) v1(2.38,28.36) v1(2.38,26.36) v1(2.38,24.36) v1(2.38,22.36) v1(2.38,20.36) v1(2.38,18.36) v1(2.38,16.36) v1(2.38,14.36) v1(2.38,12.36) v1(2.38,10.36) v1(2.38,8.36) v1(2.38,6.36) v1(2.38,4.36) v1(4.38,64.36) v1(4.38,62.36) v1(4.38,60.36) v1(4.38,58.36) v1(4.38,56.36) v1(4.38,54.36) v1(4.38,52.36) v1(4.38,50.36) v1(4.38,48.36) v1(4.38,46.36) v1(4.38,44.36) v1(4.38,42.36) v1(4.38,40.36) v1(4.38,38.36) v1(4.38,36.36) v1(4.38,34.36) v1(4.38,32.36) v1(4.38,30.36) v1(4.38,28.36) v1(4.38,26.36) v1(4.38,24.36) v1(4.38,22.36) v1(4.38,20.36) v1(4.38,18.36) v1(4.38,16.36) v1(4.38,14.36) v1(4.38,12.36) v1(4.38,10.36) v1(4.38,8.36) v1(4.38,6.36) v1(4.38,4.36) v1(6.38,64.36) v1(6.38,62.36) v1(6.38,60.36) v1(6.38,56.36) v1(6.38,54.36) v1(6.38,52.36) v1(6.38,50.36) v1(6.38,48.36) v1(6.38,46.36) v1(6.38,44.36) v1(6.38,42.36) v1(6.38,40.36) v1(6.38,38.36) v1(6.38,36.36) v1(6.38,34.36) v1(6.38,32.36) v1(6.38,30.36) v1(6.38,28.36) v1(6.38,26.36) v1(6.38,24.36) v1(6.38,22.36) v1(6.38,20.36) v1(6.38,18.36) v1(6.38,16.36) v1(6.38,14.36) v1(6.38,12.36) v1(6.38,10.36) v1(6.38,8.36) v1(6.38,6.36) v1(6.38,4.36) v1(8.38,66.36) v1(8.38,64.36) v1(8.38,62.36) v1(8.38,60.36) v1(8.38,58.36) v1(8.38,56.36) v1(8.38,54.36) v1(8.38,52.36) v1(8.38,50.36) v1(8.38,48.36) v1(8.38,44.36) v1(8.38,42.36) v1(10.13,19.15) v1(10.13,11.15) v1(10.38,66.36) v1(10.38,62.36) v1(10.38,60.36) v1(10.38,56.36) v1(10.38,54.36) v1(10.38,52.36) v1(10.38,50.36) v1(10.38,48.36) v1(10.38,36.36) v1(12.38,70.36) v1(12.38,66.36) v1(12.38,62.36) v1(12.38,60.36) v1(12.38,54.36) v1(12.38,50.36) v1(12.38,48.36) v1(12.38,46.36) v1(14.38,70.36) v1(14.38,66.36) v1(14.38,64.36) v1(14.38,62.36) v1(14.38,60.36) v1(14.38,58.36) v1(14.38,56.36) v1(14.38,48.36) v1(14.38,46.36) v1(14.38,44.36) v1(16.38,72.36) v1(16.38,66.36) v1(16.38,64.36) v1(16.38,62.36) v1(16.38,60.36) v1(16.38,58.36) v1(16.38,56.36) v1(16.38,54.36) v1(16.38,52.36) v1(16.38,50.36) v1(16.38,46.36) v1(16.38,44.36) v1(18.13,7.15) v1(18.38,74.36) v1(18.38,70.36) v1(18.38,68.36) v1(18.38,66.36) v1(18.38,64.36) v1(20.38,68.36) v1(20.38,66.36) v1(20.38,62.36) v1(20.38,60.36) v1(20.38,2.36) v1(22.38,74.36) v1(22.38,68.36) v1(22.38,64.36) v1(22.38,62.36) v1(22.38,60.36) v1(22.38,58.36) v1(22.38,2.36) v1(24.38,76.36) v1(24.38,74.36) v1(24.38,64.36) v1(24.38,62.36) v1(24.38,60.36) v1(24.38,58.36) v1(24.38,2.36) v1(26.38,40.36) v1(26.38,38.36) v1(26.38,2.36) v1(28.13,25.15) v1(28.38,54.36) v1(28.38,42.36) v1(28.38,40.36) v1(28.38,38.36) v1(28.38,2.36) v1(30.38,54.36) v1(30.38,40.36) v1(30.38,38.36) v1(30.38,2.36) v1(32.38,54.36) v1(32.38,38.36) v1(32.38,2.36) v1(34.38,42.36) v1(34.38,36.36) v1(34.38,2.36) v1(36.38,40.36) v1(36.38,2.36) v1(38.13,33.15) v1(38.13,29.15) v1(38.38,54.36) v1(38.38,38.36) v1(38.38,2.36) v1(40.38,54.36) v1(40.38,52.36) v1(40.38,44.36) v1(40.38,36.36) v1(40.38,2.36) v1(42.13,25.15) v1(42.38,54.36) v1(42.38,52.36) v1(42.38,44.36) v1(42.38,42.36) v1(42.38,2.36) v1(44.38,44.36) v1(44.38,42.36) v1(44.38,40.36) v1(44.38,2.36) v1(46.13,25.15) v1(46.13,5.15) v1(46.38,44.36) v1(46.38,42.36) v1(46.38,40.36) v1(46.38,2.36) v1(48.38,48.36) v1(48.38,44.36) v1(48.38,42.36) v1(48.38,40.36) v1(48.38,2.36) v1(50.38,48.36) v1(50.38,44.36) v1(50.38,42.36) v1(50.38,40.36) v1(50.38,2.36) v1(52.13,5.15) v1(52.38,44.36) v1(52.38,42.36) v1(52.38,40.36) v1(52.38,2.36) v1(54.38,44.36) v1(54.38,42.36) v1(54.38,40.36) v1(54.38,2.36) v1(56.13,21.15) v1(56.38,44.36) v1(56.38,42.36) v1(56.38,40.36) v1(56.38,2.36) v1(58.13,21.15) v1(58.38,48.36) v1(58.38,44.36) v1(58.38,42.36) v1(58.38,40.36) v1(59.53,2.61) v1(60.13,33.15) v1(60.13,29.15) v1(60.38,48.36) v1(60.38,46.36) v1(60.38,40.36) v1(61.91,2.61) v1(62.13,25.15) v1(62.38,54.36) v1(62.38,48.36) v1(62.38,46.36) v1(62.38,44.36) v1(62.38,42.36) v1(62.38,40.36) v1(64.13,27.15) v1(64.13,23.15) v1(64.38,54.36) v1(64.38,48.36) v1(64.38,46.36) v1(64.38,44.36) v1(64.38,42.36) v1(64.38,40.36) v1(64.93,2.61) v1(66.13,25.15) v1(66.13,15.15) v1(67.69,2.61) v1(70.38,54.36) v1(70.38,52.36) v1(70.38,48.36) v1(70.38,46.36) v1(70.42,2.61) v1(72.13,21.15) v1(72.38,54.36) v1(72.38,52.36) v1(72.38,48.36) v1(72.38,46.36) v1(72.93,2.61) v1(74.38,54.36) v1(74.38,52.36) v1(74.38,48.36) v1(74.38,46.36) v1(76.38,2.36) v1(78.38,2.36) v1(80.13,5.15) v1(80.38,50.36) v1(80.38,48.36) v1(80.38,38.36) v1(80.38,2.36) v1(82.38,74.36) v1(82.38,72.36) v1(82.38,70.36) v1(82.38,68.36) v1(82.38,66.36) v1(82.38,64.36) v1(82.38,62.36) v1(82.38,58.36) v1(82.38,56.36) v1(82.38,54.36) v1(82.38,52.36) v1(82.38,50.36) v1(82.38,44.36) v1(82.38,42.36) v1(82.38,36.36) v1(84.13,31.15) v1(84.38,72.36) v1(84.38,70.36) v1(84.38,48.36) v1(84.38,44.36) v1(84.38,42.36) v1(86.13,29.15) v1(86.38,70.36) v1(86.38,66.36) v1(86.38,64.36) v1(86.38,62.36) v1(86.38,60.36) v1(86.38,58.36) v1(86.38,54.36) v1(86.38,52.36) v1(86.38,50.36) v1(88.38,62.36) v1(88.38,60.36) v1(88.38,58.36) v1(88.38,56.36) v1(88.38,52.36) v1(88.38,50.36) v1(88.38,48.36) v1(88.38,42.36) v1(90.13,19.15) v1(90.38,68.36) v1(90.38,66.36) v1(90.38,64.36) v1(90.38,62.36) v1(90.38,60.36) v1(90.38,58.36) v1(90.38,56.36) v1(90.38,54.36) v1(90.38,50.36) v1(90.38,48.36) v1(90.38,44.36) v1(90.38,36.36) v1(92.38,66.36) v1(92.38,64.36) v1(92.38,62.36) v1(92.38,60.36) v1(92.38,58.36) v1(92.38,56.36) v1(92.38,54.36) v1(92.38,52.36) v1(92.38,30.36) v1(92.38,28.36) v1(92.38,26.36) v1(92.38,24.36) v1(92.38,22.36) v1(92.38,20.36) v1(92.38,18.36) v1(92.38,16.36) v1(94.38,64.36) v1(94.38,62.36) v1(94.38,60.36) v1(94.38,58.36) v1(94.38,56.36) v1(94.38,54.36) v1(94.38,52.36) v1(94.38,50.36) v1(94.38,48.36) v1(94.38,46.36) v1(94.38,44.36) v1(94.38,42.36) v1(94.38,40.36) v1(94.38,38.36) v1(94.38,36.36) v1(94.38,34.36) v1(94.38,32.36) v1(94.38,30.36) v1(94.38,28.36) v1(94.38,26.36) v1(94.38,24.36) v1(94.38,22.36) v1(94.38,20.36) v1(94.38,18.36) v1(94.38,16.36) v1(94.38,14.36) v1(94.38,12.36) v1(94.38,10.36) v1(94.38,8.36) v1(96.38,64.36) v1(96.38,62.36) v1(96.38,60.36) v1(96.38,58.36) v1(96.38,56.36) v1(96.38,54.36) v1(96.38,52.36) v1(96.38,50.36) v1(96.38,48.36) v1(96.38,46.36) v1(96.38,44.36) v1(96.38,42.36) v1(96.38,40.36) v1(96.38,38.36) v1(96.38,36.36) v1(96.38,34.36) v1(96.38,32.36) v1(96.38,30.36) v1(96.38,28.36) v1(96.38,26.36) v1(96.38,24.36) v1(96.38,22.36) v1(96.38,20.36) v1(96.38,18.36) v1(96.38,16.36) v1(96.38,14.36) v1(96.38,12.36) v1(96.38,10.36) v1(96.38,8.36) v1(96.38,6.36) v1(96.38,4.36) v1(98.38,26.36) v1(98.38,24.36) v1(98.38,22.36) v1(98.38,20.36) v1(98.38,18.36) v1(98.38,16.36) v1(98.38,14.36) v1(98.38,12.36) v1(98.38,10.36) v1(98.38,8.36) v1(98.38,6.36) v1(98.38,4.36)
V1: length 37.2
  Inner1 w0.254: U18.11 27.08,40.53 27.08,25.15 38.25,13.97 U10.14
V2: length 40.5
  Inner1 w0.254: U10.24 13.11,13.97 8.36,18.72 8.36,31.32 8.54,31.5 13.03,31.5 v1(15.06,33.53)
  Inner2 w0.254: v1(15.06,33.53) 15.14,33.6 15.14,36.58 19.2,40.64 21.99,40.64 U18.13
V3: length 35.5
  Inner1 w0.254: U10.15 35.71,13.97 26.57,23.11 26.57,35.73 24.2,38.1 22.72,38.1 22,38.82 22,40.53 U18.14
V4: length 23.7
  Inner1 w0.254: U10.17 30.89,13.97 26.06,18.8 26.06,31.39 U18.19
V5: length 21
  Inner1 w0.254: U18.22 22,30.37 22,20.57 U10.18
2_LED: length 106.3
  Top Layer w0.254: U18.42 84.49,49.8 R35.1 78.13,67.56 74.07,71.63 74.07,75.18 70.77,78.49 24.28,78.49 16.15,70.35 R33.1
ADC_INA00: length 70.2
  Top Layer w0.254: 76.86,31.75 76.61,31.5 74.58,31.5 67.46,38.61 44.86,38.61 36.75,46.71 36.75,58.53 31.09,64.19 U15.16 31.09,67.82 30.93,67.98
ADC_INA01: length 83.1
  Top Layer w0.254: U15.15 33.63,67.82 31.99,69.46 30.4,69.46 29.55,68.62 29.55,64.64 36.27,57.92 36.27,46.54 44.67,38.14 67.17,38.14 74.85,30.46 78.11,30.46 79.4,31.75
ADC_INA02: length 88.8
  Top Layer w0.254: U15.14 36.17,67.82 36.01,67.98 35.95,67.98 34.11,69.82 27.15,69.82 26.31,68.98 26.31,67.06 35.79,57.58 35.79,46.32 44.45,37.66 66.89,37.66 75.58,28.97 76.62,28.97 76.86,29.21
ADC_INA03: length 96.4
  Top Layer w0.254: U15.13 38.55,65.14 38.55,67.98 36.23,70.3 26.91,70.3 25.96,69.35 25.96,69.13 25.96,69.13 25.96,66.91 25.96,66.9 25.96,66.69 35.31,57.34 35.31,57.32 35.38,57.25 35.38,46.03 44.23,37.18 66.51,37.18 75.08,28.61 75.5,28.61 76.3,27.82 77.55,27.82 78.94,29.21 79.4,29.21
ADC_INA04: length 100.4
  Top Layer w0.254: 76.86,26.67 76.35,26.67 66.32,36.7 43.95,36.7 34.77,45.88 34.77,57.1 25.35,66.52 25.35,69.7 28.35,72.7 36.75,72.7 37.47,71.98 37.47,71.02 39.39,69.1 40.11,69.1 41.09,68.12 41.09,67.98 41.25,67.82 U15.12
ADC_INA05: length 108.8
  Top Layer w0.254: U15.11 43.63,65.14 43.63,68.22 42.75,69.1 42.03,69.1 40.11,71.02 40.11,72.22 39.15,73.18 28.11,73.18 24.87,69.94 24.87,66.34 34.35,56.86 34.35,45.58 43.71,36.22 66.04,36.22 74.67,27.59 74.67,26.86 76.11,25.42 78.15,25.42 79.4,26.67
ADC_INA06: length 114
  Top Layer w0.254: 76.86,24.13 76.05,24.94 75.87,24.94 74.19,26.62 74.19,27.31 65.76,35.74 43.47,35.74 33.87,45.34 33.87,56.62 24.39,66.1 24.39,72.75 27.22,75.58 39.15,75.58 39.87,74.86 39.87,73.42 40.59,72.7 41.79,72.7 42.51,71.98 42.51,71.26 44.67,69.1 45.15,69.1 46.17,68.08 46.17,67.98 46.33,67.82 U15.10
ADC_INA07: length 123
  Top Layer w0.254: 48.71,68.18 48.87,68.02 U15.9 ; 48.71,68.18 47.07,69.82 46.11,69.82 45.15,70.78 45.15,72.22 44.67,72.7 43.59,72.7 42.27,74.02 42.27,75.1 41.31,76.06 26.94,76.06 23.91,73.03 23.91,65.86 33.39,56.38 33.39,45.1 43.23,35.26 65.48,35.26 73.71,27.03 73.71,25.25 76.18,22.78 78.05,22.78 79.4,24.13 ; 48.71,68.18 48.71,67.98
ADC_INB00: length 55.2
  Top Layer w0.254: U52.9 51.41,67.84 U15.8 56.41,59.98 64.83,59.98 65.79,59.02 65.79,41.5 74.19,33.1 78.21,33.1 79.4,34.29
ADC_INB01: length 49.2
  Top Layer w0.254: U52.8 53.95,67.84 U15.7 58.47,60.46 65.07,60.46 66.27,59.26 66.27,41.74 73.72,34.29 76.86,34.29
ADC_INB02: length 49.2
  Top Layer w0.254: 79.4,36.83 78.07,35.5 73.23,35.5 66.75,41.98 66.75,59.5 65.31,60.94 60.53,60.94 U15.6 56.49,67.84 U52.7
ADC_INB03: length 43.1
  Top Layer w0.254: 76.86,36.83 72.51,36.83 67.23,42.11 67.23,59.74 65.55,61.42 62.59,61.42 U15.5 59.33,65.28 U52.6
ADC_INB04: length 43.2
  Top Layer w0.254: U52.5 61.87,65.28 U15.4 61.57,64.92 64.59,61.9 65.79,61.9 67.71,59.98 67.71,42.22 71.79,38.14 78.17,38.14 79.4,39.37
ADC_INB05: length 37.4
  Top Layer w0.254: U52.4 64.41,65.28 U15.3 64.11,64.3 68.19,60.22 68.19,42.46 71.28,39.37 76.86,39.37
ADC_INB06: length 38.6
  Top Layer w0.254: U52.3 66.95,65.28 U15.2 68.67,62.96 68.67,42.7 70.83,40.54 78.03,40.54 79.4,41.91
ADC_INB07: length 33.5
  Top Layer w0.254: 76.86,41.91 71.32,41.91 71.31,41.9 70.25,41.9 70.24,41.91 70.18,41.91 69.15,42.94 69.15,64.94 U15.1 69.19,67.84 U52.2
BUZZ: length 32.9
  Top Layer w0.254: R34.2 13.12,52.32 17.17,48.26 24.03,48.26 25.05,47.24 25.05,30.99 U18.23
GPIO0: length 26.5
  Top Layer w0.254: U4.0 89.53,38.07 R9.1
  Bottom Layer w0.254: U4.0 88.29,36.83 83.72,36.83 79.91,40.64 75.85,40.64 74.83,41.66 74.83,45.47 76.3,46.94 U18.39
GPIO1: length 18.7
  Top Layer w0.254: U4.1 89.49,40.57 R10.1
  Bottom Layer w0.254: U4.1 88.29,39.37 83.72,39.37 79.91,43.18 77.88,43.18 76.66,44.4 U18.41
GPIO2: length 16
  Top Layer w0.254: U4.2 89.53,43.15 R11.1
  Bottom Layer w0.254: U18.40 87.33,46.94 88.29,45.97 88.29,44.74 88.27,44.72 89.56,43.43 U4.2
GPIO3: length 15.1
  Top Layer w0.254: U4.3 89.53,45.69 R12.1
  Bottom Layer w0.254: U4.3 85.8,49.48 U18.38
GPIO4: length 40.2
  Top Layer w0.254: R25.1 43.87,50.57 U50.1
  Bottom Layer w0.254: U50.1 43.81,50.26 45.11,51.56 64.58,51.56 65.34,50.8 77.87,50.8 U18.36
GPIO5: length 48.3
  Top Layer w0.254: U50.2 46.27,50.43 R26.1
  Bottom Layer w0.254: U50.2 44.61,48.77 42.57,48.77 42.06,49.28 42.06,51.05 43.33,52.32 64.42,52.32 65.43,53.34 77.87,53.34 U18.34
GPIO6: length 35.7
  Top Layer w0.254: U50.3 48.87,50.49 R27.1
  Bottom Layer w0.254: U18.4 21.99,55.88 34.7,55.88 42.32,48.26 46.64,48.26 U50.3
GPIO7: length 37.6
  Top Layer w0.254: U50.4 51.47,50.55 R28.1
  Bottom Layer w0.254: U50.4 48.68,47.75 42.06,47.75 36.48,53.34 22.51,53.34 21.19,52.02 U18.6
GPIO8: length 36.9
  Top Layer w0.254: U50.5 53.97,50.51 R29.1
  Bottom Layer w0.254: U18.5 37.03,52.02 41.81,47.24 50.71,47.24 U50.5
GPIO9: length 42.3
  Top Layer w0.254: U50.6 56.47,50.47 R30.1
  Bottom Layer w0.254: U50.6 52.74,46.74 41.56,46.74 37.49,50.8 21.99,50.8 U18.8
GPIO10: length 44.2
  Top Layer w0.254: R31.1 58.97,50.43 U50.7
  Bottom Layer w0.254: U50.7 54.77,46.23 41.3,46.23 39.27,48.26 21.99,48.26 U18.10
GPIO11: length 47.1
  Top Layer w0.254: U50.8 61.47,50.39 R32.1
  Bottom Layer w0.254: U50.8 56.9,45.81 41.02,45.81 39.84,46.99 25.81,46.99 24.63,45.81 22.6,45.81 21.19,44.4 U18.12
GPIO12: length 28
  Top Layer w0.254: R13.1 12.73,45.72 U48.0
  Bottom Layer w0.254: U48.0 11.84,43.43 11.84,37.34 13.62,35.56 21.49,35.56 22,35.05 22,33.27 23.21,32.06 U18.21
GPIO13: length 21
  Top Layer w0.254: R14.1 12.73,43.18 U48.1
  Bottom Layer w0.254: U48.1 11.33,41.4 11.33,37.08 14.17,34.24 U18.20
GPIO14: length 27.5
  Top Layer w0.254: R15.1 9.9,40.29 U48.2
  Bottom Layer w0.254: U48.2 8.28,39.37 8.28,33.73 17.93,24.08 U18.28
GPIO15: length 25.8
  Top Layer w0.254: U48.3 12.73,38.1 R16.1
  Bottom Layer w0.254: U48.3 9.55,33.53 17.68,25.4 21.89,25.4 U18.27
L_LED: length 80.9
  Inner1 w0.254: U53.14 64.13,78.49 29.36,78.49 26.57,75.69 26.57,70.75 18.7,62.88 18.7,41.66 20.67,39.68 U18.16
PUB_LED4: length 31.9
  Bottom Layer w0.254: U53.1 32.13,79.73 29.87,77.47 29.87,71.09 32.39,68.57 32.39,67.71 32.41,67.69 32.41,63.5 35.21,60.71 40.74,60.71 U50.18
PUB_LED5: length 32.3
  Bottom Layer w0.254: U50.17 42.77,61.21 36.73,61.21 34.93,63.01 34.93,68.57 32.37,71.13 32.37,75.65 33.43,76.71 33.43,78.49 34.67,79.73 U53.2
PUB_LED6: length 31.9
  Bottom Layer w0.254: U53.3 36.22,78.52 36.22,76.45 34.97,75.2 34.97,71.11 37.49,68.59 37.47,68.57 37.47,63.27 39.02,61.72 44.8,61.72 U50.16
PUB_LED7: length 31.8
  Bottom Layer w0.254: U53.4 38.76,78.52 38.76,76.71 37.51,75.46 37.51,71.07 40.01,68.57 40.01,63.52 41.3,62.23 46.83,62.23 U50.15
PUB_LED8: length 31.5
  Bottom Layer w0.254: U53.5 41.3,78.52 41.3,76.71 40.05,75.46 40.05,71.15 42.55,68.65 42.55,64.03 43.84,62.74 48.87,62.74 U50.14
PUB_LED9: length 31.3
  Bottom Layer w0.254: U50.13 50.9,63.25 46.38,63.25 45.11,64.52 45.11,67.69 45.09,67.71 45.09,68.57 45.11,68.59 42.58,71.13 42.58,75.7 43.71,76.84 43.71,78.49 44.96,79.73 U53.6
PUB_LED10: length 28.7
  Bottom Layer w0.254: U53.7 48.92,78.4 48.92,76.71 47.65,75.44 47.65,71.23 50.19,68.69 50.19,64.52 50.95,63.75 52.93,63.75 U50.12
PUB_LED11: length 27.2
  Bottom Layer w0.254: U53.8 50.22,79.73 51.21,78.74 51.21,76.2 50.45,75.44 50.45,71.22 50.57,71.09 50.57,71.07 51.18,70.46 51.2,70.46 52.99,68.68 52.99,67.82 55.27,65.53 55.27,63.95 U50.11
Q0: length 6.4
  Bottom Layer w0.254: U16.16 30.93,71.86 U11.2 30.93,75.77 U53.16
Q1: length 6.4
  Bottom Layer w0.254: U16.15 33.47,71.86 U11.3 33.47,75.77 U53.17
Q2: length 6.4
  Bottom Layer w0.254: U16.14 36.37,74.1 U11.4 36.01,75.23 37.43,76.65 U53.18
Q3: length 6.4
  Bottom Layer w0.254: U16.13 38.55,71.86 U11.5 38.76,74.67 38.76,75.98 U53.19
Q4: length 6.4
  Bottom Layer w0.254: U16.12 41.09,71.86 U11.6 41.09,75.48 42.51,76.9 U53.20
Q5: length 6.4
  Bottom Layer w0.254: U16.11 43.63,71.86 U11.7 43.63,75.77 U53.21
Q6: length 6.4
  Bottom Layer w0.254: U53.22 46.17,75.77 U11.8 46.53,74.1 U16.10
Q7: length 6.4
  Bottom Layer w0.254: U16.9 49.07,74.1 U11.9 48.71,75.77 U53.23
Q8: length 6.1
  Bottom Layer w0.254: U53.24 52.67,76.9 51.72,75.95 51.72,74.38 U12.9 51.71,71.6 U16.8
Q9: length 6.1
  Bottom Layer w0.254: U53.25 54.25,76.23 U12.8 54.25,71.6 U16.7
Q10: length 6.1
  Bottom Layer w0.254: U53.26 57.75,76.9 56.8,75.95 56.8,74.38 U12.7 56.79,71.6 U16.6
Q11: length 6.1
  Bottom Layer w0.254: U53.27 59.33,76.23 U12.6 59.33,71.6 U16.5
Q12: length 6.1
  Bottom Layer w0.254: U53.28 61.87,76.23 U12.5 61.87,71.6 U16.4
Q13: length 6.1
  Bottom Layer w0.254: U53.29 64.41,76.23 U12.4 64.41,71.6 U16.3
Q14: length 6.1
  Bottom Layer w0.254: U16.2 66.95,71.6 U12.3 66.95,76.23 U53.30
Q15: length 8.9
  Bottom Layer w0.254: U53.15 69.49,78.15 U12.2 69.49,71.6 U16.1
R_LED: length 72.7
  Inner1 w0.254: U53.9 51.63,80.77 30.89,80.77 26.06,75.95 26.06,71.12 18.19,63.25 18.19,38.86 20.27,36.78 U18.18
SW_D: length 119.3
  Top Layer w0.254: R23.2 85.69,5.28 U57.D 73.7,17.27 20.98,17.27 16.41,21.84 16.41,36.65 20.2,40.45 23.33,40.45 23.52,40.64 23.78,40.64 24.54,39.88 24.54,38.86 23.78,38.1 22.76,38.1 22,37.34 22,27.83 U18.25
SW_L: length 99.7
  Top Layer w0.254: R22.2 88,10.93 U57.L 75.73,17.78 21.24,17.78 16.92,22.1 16.92,35.56 19.46,38.1 21.99,38.1 U18.15
SW_R: length 123.9
  Top Layer w0.254: R24.2 92.76,8.07 U57.R 95.15,5.98 95.15,5.08 93.88,3.81 84.74,3.81 71.78,16.76 20.73,16.76 15.9,21.59 15.9,41.91 19.71,45.72 21.99,45.72 U18.9
SW_U: length 80.4
  Top Layer w0.254: U18.26 17.43,23.37 17.43,22.35 21.49,18.29 80.3,18.29 U57.U 87.89,13.3 R21.2
$1N3052: length 67.2
  Inner1 w0.254: U1.2 45.34,22.44 45.34,27.71 29.62,43.43 27.23,43.43 26.57,44.1 L1.1
  Inner2 w0.254: D1.2 58.74,43.9 58.62,43.77 40.14,43.77 40.01,43.9 27.63,43.9 L1.1
$1N13779: length 6.6
  Top Layer w0.254: U6.2 14.62,54.62 R34.1
$1N16910: length 3.3
  Top Layer w0.254: R33.2 14.49,67.67 U60.2
$1N16913: length 2.8
  Top Layer w0.254: R35.2 88.78,67.56 U54.2

## Copper pours and planes (outline as drawn; the poured copper is in the pictures)
50V on Bottom Layer: 8.28,37.6 90.83,37.6 90.83,2.79 8.28,2.79
50V on Inner2: 8.28,37.67 90.83,37.67 90.83,2.79 8.28,2.79
AGND on Top Layer: 26.83,81.75 80.16,81.75 80.16,55.88 26.83,55.88
AGND on Bottom Layer: 26.83,81.75 80.16,81.75 80.16,55.88 26.83,55.88
AGND on Inner1: 26.83,81.75 80.16,81.75 80.16,55.88 26.83,55.88
AGND on Inner2: 26.68,81.96 80.16,81.96 80.16,55.88 26.68,55.88
GND on Top Layer: -2.39,83.57 101.75,83.57 101.75,-0.76 -2.39,-0.76
GND on Bottom Layer: -2.13,83.82 101.75,83.82 101.75,-0.76 -2.13,-0.76
GND on Inner1: -1.88,83.82 102.01,83.82 102.01,-0.51 -1.88,-0.51
GND on Inner2: -2.13,83.82 102.52,83.82 102.52,-0.51 -2.13,-0.51
$1N2932 on Bottom Layer: 58.57,6.86 73.81,6.86 73.81,1.78 58.57,1.78
$1N2932 on Inner2: 58.57,6.86 73.81,6.86 73.81,1.78 58.57,1.78
